# Altium project IoT_ChamSocBenhNhan.PrjPcb
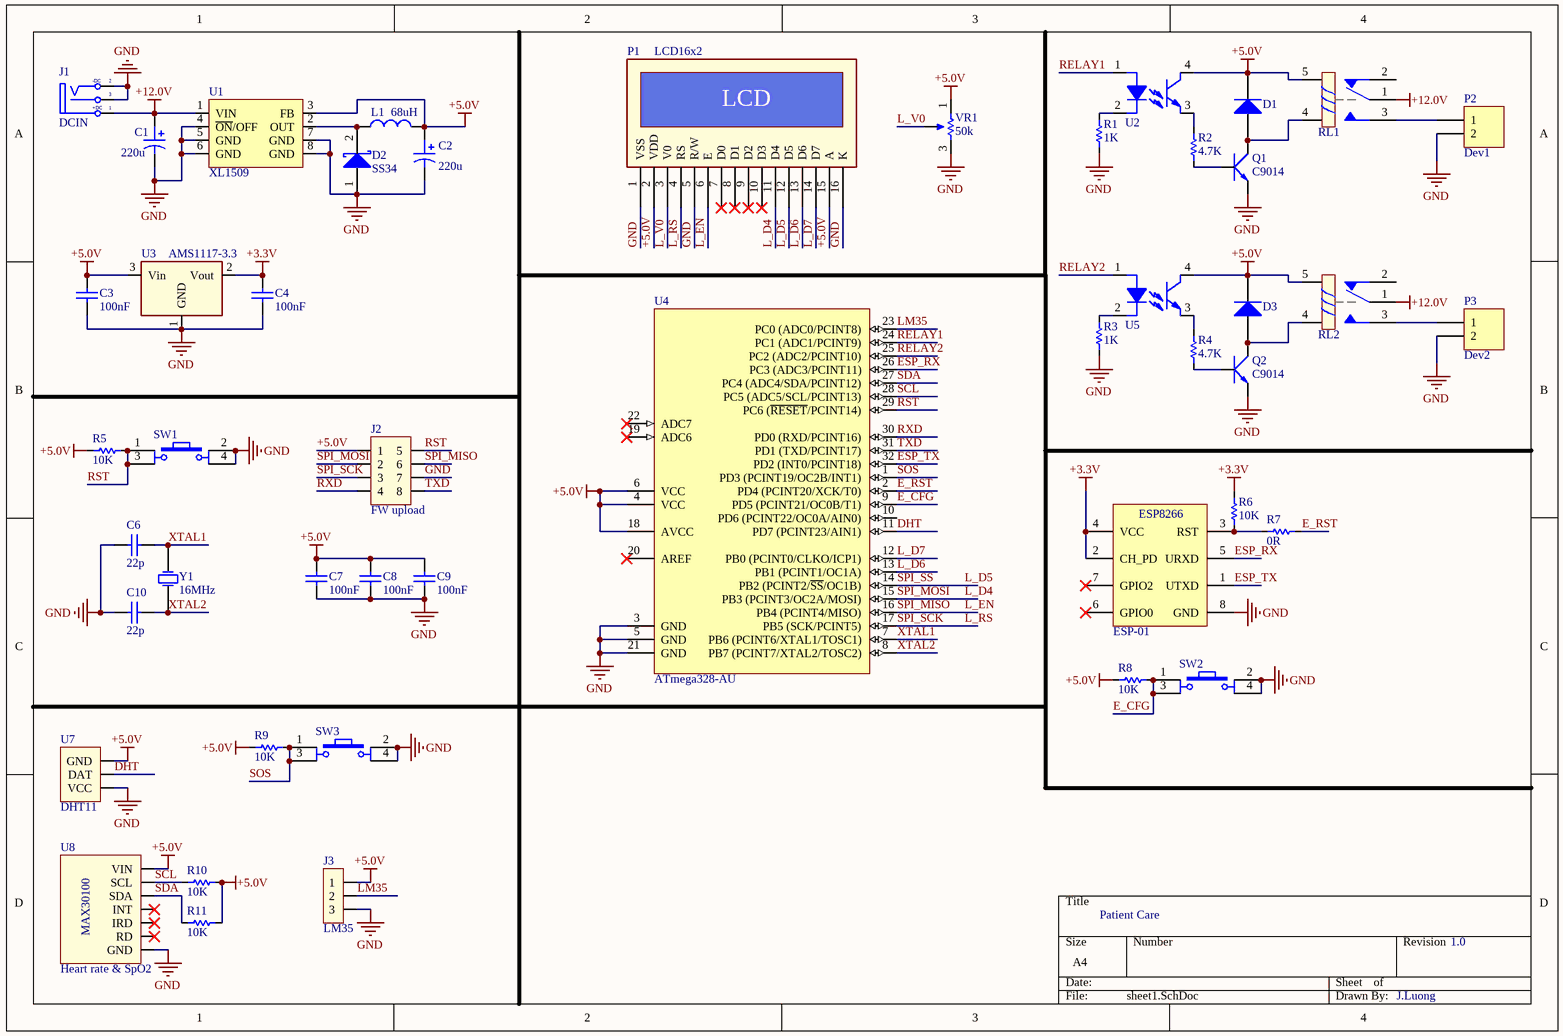
[diagram p0: sheet1.SchDoc]
1 sheet, 47 parts. Net scope: global (net labels, ports and power ports of the same name join across sheets).
Board file: PCB.PcbDoc

## Sheet sheet1.SchDoc
size A4

### Parts
C1  value 220u  [CAP_SMD_7343]  (hidden comment: Cap Pol)
C2  value 220u  [CAP_SMD_7343]  (hidden comment: Cap Pol)
C3  value 100nF  [CAP_SMD_0805]  (hidden comment: Cap Non-pol)
C4  value 100nF  [CAP_SMD_0805]  (hidden comment: Cap Non-pol)
C6  value 22p  [CAP_SMD_0805]  (hidden comment: Cap Non-pol)
C7  value 100nF  [CAP_SMD_0805]  (hidden comment: Cap Non-pol)
C8  value 100nF  [CAP_SMD_0805]  (hidden comment: Cap Non-pol)
C9  value 100nF  [CAP_SMD_0805]  (hidden comment: Cap Non-pol)
C10  value 22p  [CAP_SMD_0805]  (hidden comment: Cap Non-pol)
D1  Diode Power  [DO-214AC,SMA]  (value not drawn)
D2  SS34  [DO-214AC,SMA]
D3  Diode Power  [DO-214AC,SMA]  (value not drawn)
J1  DCIN  [DC-IN]
J2  FW upload  [JP4x2]
J3  LM35  [JP3]
L1  value 68uH  [CDRH60]  (hidden comment: Inductor)
P1  LCD16x2  [LCD16x2]
P2  Dev1  [TBlock 2]
P3  Dev2  [TBlock 2]
Q1  C9014  [SOT23C]
Q2  C9014  [SOT23C]
R1  value 1K  [RES_SMD_0603]  (hidden comment: RESISTOR)
R2  value 4.7K  [RES_SMD_0603]  (hidden comment: RESISTOR)
R3  value 1K  [RES_SMD_0603]  (hidden comment: RESISTOR)
R4  value 4.7K  [RES_SMD_0603]  (hidden comment: RESISTOR)
R5  value 10K  [RES_SMD_0805]  (hidden comment: RESISTOR)
R6  value 10K  [RES_SMD_0805]  (hidden comment: RESISTOR)
R7  value 0R  [RES_SMD_0805]  (hidden comment: RESISTOR)
R8  value 10K  [RES_SMD_0805]  (hidden comment: RESISTOR)
R9  value 10K  [RES_SMD_0805]  (hidden comment: RESISTOR)
R10  value 10K  [RES_SMD_0805]  (hidden comment: RESISTOR)
R11  value 10K  [RES_SMD_0805]  (hidden comment: RESISTOR)
RL1  RELAY5V  [RELAY5]  (value not drawn)
RL2  RELAY5V  [RELAY5]  (value not drawn)
SW1  SW  [SW4]  (value not drawn)
SW2  SW  [SW4]  (value not drawn)
SW3  SW  [SW4_12MM]  (value not drawn)
U1  XL1509  [SOP8]
U2  PC817  [DIP4]  (value not drawn)
U3  AMS1117-3.3  [SOT223]
U4  ATmega328-AU  [TQFP32A]
U5  PC817  [DIP4]  (value not drawn)
U6  ESP-01  [ESP8266]
U7  DHT11  [DHT11]
U8  Heart rate & SpO2  [MAX30100]
VR1  50k  [VRes-R]
Y1  16MHz  [XTAL]

### Nets
+3.3V: C4.2 R6.1 U3.2(Vout) U6.2(CH_PD) U6.4(VCC)
+5.0V: C2.1 C3.2 C7.2 C8.2 C9.2 D1.2(K) D3.2(K) J2.1 J3.1 L1.2 P1.2(VDD) P1.15(A) R5.2 R8.2 R9.2 R10.1 R11.1 RL1.5 RL2.5 U1.3(FB) U2.4 U3.3(Vin) U4.4(VCC) U4.6(VCC) U4.18(AVCC) U5.4 U7.1(GND) U8.1(VIN) VR1.1
+12.0V: C1.1 J1.1(T) RL1.1 RL2.1 U1.1(VIN)
GND: C1.2 C2.2 C3.1 C4.1 C6.1 C7.1 C8.1 C9.1 C10.1 D2.1(A) J1.2(TN) J1.3(S) J2.7 J3.3 P1.1(VSS) P1.5(R/W) P1.16(K) P2.2 P3.2 Q1.1(E) Q2.1(E) R1.1 R3.1 SW1.2 SW1.4 SW2.2 SW2.4 SW3.2 SW3.4 U1.4(~{ON}/OFF) U1.5(GND) U1.6(GND) U1.7(GND) U1.8(GND) U3.1(GND) U4.3(GND) U4.5(GND) U4.21(GND) U6.8(GND) U7.3(VCC) U8.7(GND) VR1.3
DHT: U4.11(PD7_(PCINT23/AIN1)) U7.2(DAT)
E_CFG: R8.1 SW2.1 SW2.3 U4.9(PD5_(PCINT21/OC0B/T1))
E_RST: R7.2 U4.2(PD4_(PCINT20/XCK/T0))
ESP_RX: U4.26(PC3_(ADC3/PCINT11)) U6.5(URXD)
ESP_TX: U4.32(PD2_(INT0/PCINT18)) U6.1(UTXD)
L_D4: J2.2 P1.11(D4) U4.15(PB3_(PCINT3/OC2A/MOSI))  [also labelled SPI_MOSI]
L_D5: P1.12(D5) U4.14(PB2_(PCINT2/~{SS}/OC1B))  [also labelled SPI_SS]
L_D6: P1.13(D6) U4.13(PB1_(PCINT1/OC1A))
L_D7: P1.14(D7) U4.12(PB0_(PCINT0/CLKO/ICP1))
L_EN: J2.6 P1.6(E) U4.16(PB4_(PCINT4/MISO))  [also labelled SPI_MISO]
L_RS: J2.3 P1.4(RS) U4.17(PB5_(SCK/PCINT5))  [also labelled SPI_SCK]
L_V0: P1.3(V0) VR1.2
LM35: J3.2 U4.23(PC0_(ADC0/PCINT8))
RELAY1: U2.1 U4.24(PC1_(ADC1/PCINT9))
RELAY2: U4.25(PC2_(ADC2/PCINT10)) U5.1
RST: J2.5 R5.1 SW1.1 SW1.3 U4.29(PC6_(~{RESET}/PCINT14))
RXD: J2.4 U4.30(PD0_(RXD/PCINT16))
SCL: R10.2 U4.28(PC5_(ADC5/SCL/PCINT13)) U8.2(SCL)
SDA: R11.2 U4.27(PC4_(ADC4/SDA/PCINT12)) U8.3(SDA)
SOS: R9.1 SW3.1 SW3.3 U4.1(PD3_(PCINT19/OC2B/INT1))
TXD: J2.8 U4.31(PD1_(TXD/PCINT17))
XTAL1: C6.2 U4.7(PB6_(PCINT6/XTAL1/TOSC1)) Y1.2(OSC2)
XTAL2: C10.2 U4.8(PB7_(PCINT7/XTAL2/TOSC2)) Y1.1(OSC1)
NetD1_1: D1.1(A) Q1.3(C) RL1.4
NetD2_2: D2.2 L1.1 U1.2(OUT)
NetD3_1: D3.1(A) Q2.3(C) RL2.4
NetP2_1: P2.1 RL1.3
NetP3_1: P3.1 RL2.3
NetQ1_2: Q1.2(B) R2.1
NetQ2_2: Q2.2(B) R4.1
NetR1_2: R1.2 U2.2
NetR2_2: R2.2 U2.3
NetR3_2: R3.2 U5.2
NetR4_2: R4.2 U5.3
NetR6_2: R6.2 R7.1 U6.3(RST)

Not connected (* = marked no-connect by the designer): P1 7(D0)* 8(D1)* 9(D2)* 10(D3)*; RL1 2; RL2 2; U4 10(PD6_(PCINT22/OC0A/AIN0)) 19(ADC6)* 20(AREF)* 22(ADC7)*; U6 6(GPIO0)* 7(GPIO2)*; U8 4(INT)* 5(IRD)* 6(RD)*

### Notes on the sheet
- Patient Care
- 1.0
- J.Luong
- (in symbol DCIN) -DC; +DC
- (in symbol ESP8266-01) ESP8266
- (in symbol LCD Text) LCD

### Library data of the parts
C1 C2 = Cap Pol: Polarized Capacitor; LatestRevisionNote: Re-released for DXP Platform.; PackageReference: POLAR0.8; Publisher: Altium Limited
C3 C4 C6-C10 = Cap Non-pol: Non-polarized Capacitor; LatestRevisionNote: Re-released for DXP Platform.; PackageReference: RAD-0.3; Publisher: Altium Limited
D2 = Diode Schottky: Schottky Rectifier; Note: Terminal 2 is the TAB and is electrically connected to the cathode; Published: 8-Jun-2000; LatestRevisionDate: 17-Jul-2002; LatestRevisionNote: Re-released for DXP Platform.; DatasheetDocument: PD-2.057B; PackageDocument: Feb-1998; PackageReference: TO-220AC; Publisher: Altium Limited; ComponentLink1Description: Manufacturer Link; ComponentLink1URL: http://www.irf.com/; ComponentLink2Description: Datasheet; ComponentLink2URL: http://www.irf.com/product-info/datasheets/data/10tq.pdf
J1 = DCIN: Jac DC input; Value: Jac DC
J2 = JP4x2: Connector 4x2; Value: Connector 4x2
J3 = JP3: Jumper 3; Value: J3
L1 = Inductor: Code_IEC: 1005; Published: 8-Jun-2000; LatestRevisionDate: 17-Jul-2002; LatestRevisionNote: Re-released for DXP Platform.; PackageReference: 0402-A; Publisher: Altium Limited; Code_JEITA: 0402
P1 = LCD Text
P2 P3 = Header 2: Header, 2-Pin; LatestRevisionDate: 17-Jul-2002; LatestRevisionNote: Re-released for DXP Platform.; Publisher: Altium Limited
Q1 Q2 = C9014: NPN 600mW, EBC; Value: C9014
RL1 RL2 = RELAY5V: Ro le 5V; Vendor: Digikey; Published: 13-April-2009; Publisher: Hoang Nguyen; ComponentLink1Description: Digikey Part Link; ComponentLink2Description: Open Datasheet; ComponentLink2URL: H:\LIBRARY\LIBRARY.Datasheet\
SW1-SW3 = SW4: Switch button 4 pin; Value: Button chip 4 pin
U2 U5 = PC817: Opto Couple; Vendor: Digikey; Fc: 80Khz; Published: 13-April-2009; Publisher: Hoang Nguyen; ComponentLink1Description: Digikey Part Link; ComponentLink2Description: Open Datasheet; ComponentLink2URL: H:\LIBRARY\LIBRARY.Datasheet\ds_PC817.pdf
U3 = AMS1117: Regulator SMD Chip; Designed By: John MacTavish; Vendor: Digikey; ComponentLink1Description: Digikey Part Link; ComponentLink2Description: Open Datasheet; ComponentLink2URL: H:\LIBRARY\LIBRARY.Datasheet\
U4 = ATmega328-AU: 8-bit AVR Microcontroller, 32KB Flash, 1KB EEPROM, 2KB SRAM, 32-pin TQFP, Industrial Grade (-40°C to 85°C)
U6 = ESP8266-01: ESP-12 Wi-Fi Module
U8 = MAX30100
VR1 = RES-VAR: Variable Resistor; Published: 8-Jun-2000; LatestRevisionDate: 17-Jul-2002; LatestRevisionNote: Re-released for DXP Platform.; PackageReference: AXIAL-0.3; Publisher: Altium Limited
Y1 = XTAL: Crystal Oscillator; Published: 8-Jun-2000; LatestRevisionDate: 17-Jul-2002; LatestRevisionNote: Re-released for DXP Platform.; PackageReference: R38; Publisher: Altium Limited
D1 D3 = Diode Power: Published: 8-Jun-2000; LatestRevisionDate: 17-Jul-2002; LatestRevisionNote: Re-released for DXP Platform.; DatasheetDocument: 1998; PackageDocument: Aug-1999; PackageReference: DO-201AD; Publisher: Altium Limited; ComponentLink1Description: Manufacturer Link; ComponentLink1URL: http://www.fairchildsemi.com/; ComponentLink2Description: Datasheet; ComponentLink2URL: http://www.fairchildsemi.com/ds/1N%2F1N5400.pdf
R1-R11 = RESISTOR: Published: 8-Jun-2000; LatestRevisionDate: 17-Jul-2002; LatestRevisionNote: Re-released for DXP Platform.; PackageReference: AXIAL-0.3; Publisher: Altium Limited